# EAGLE schematic Flex (EAGLE 6.6.0)
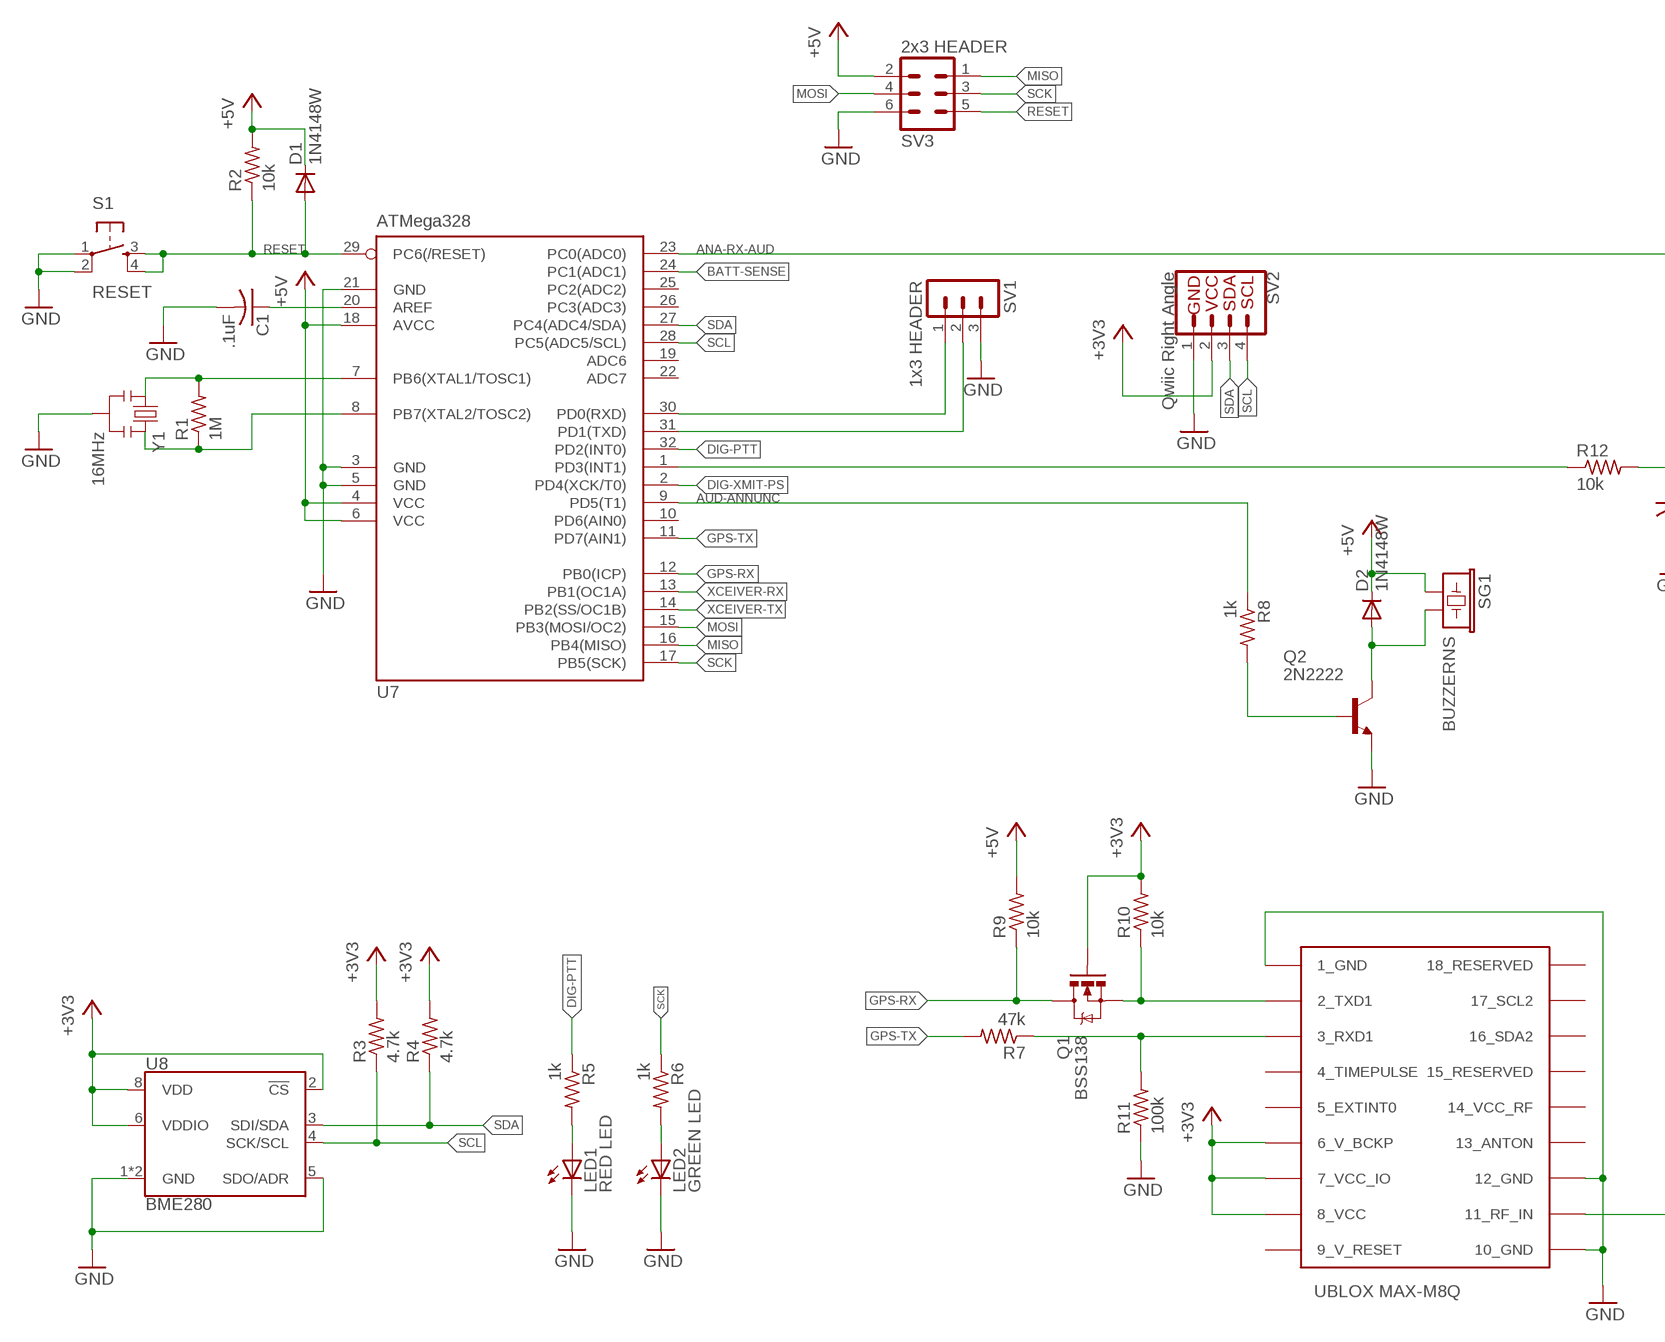
[diagram p0: schematic, sheet 1, part 1 of 2]
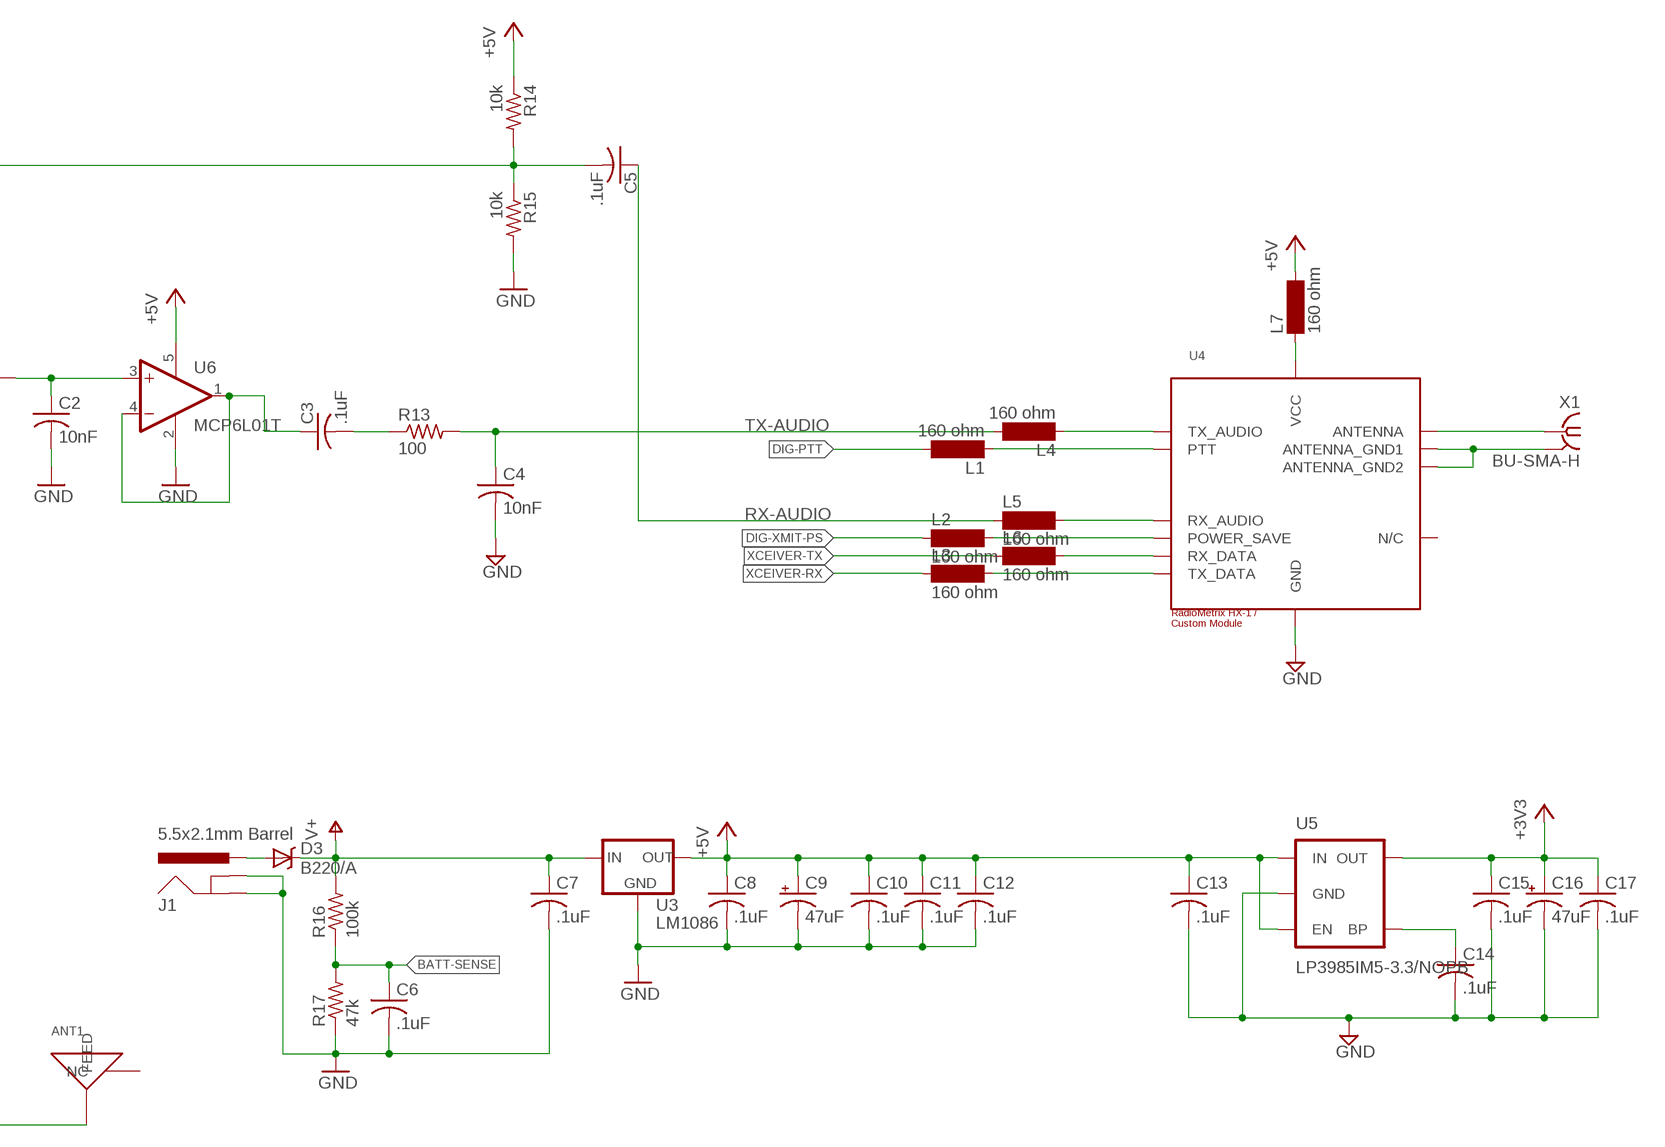
[diagram p1: schematic, sheet 1, part 2 of 2]

## Parts
ANT1  GPS ANTENNA  GPS_ANT_SMDBAR  [1575AT43A40]
C1  .1uF  C-USC0805  [C0805]
C2  10nF  C-USC0805  [C0805]
C3  .1uF  C-USC0805  [C0805]
C4  10nF  C-USC0805  [C0805]
C5  .1uF  C-USC0805  [C0805]
C6  .1uF  C-USC0805  [C0805]
C7  .1uF  C-USC0805  [C0805]
C8  .1uF  C-USC0805  [C0805]
C9  47uF  CPOL-US153CLV-0605  [153CLV-0605]
C10  .1uF  C-USC0805  [C0805]
C11  .1uF  C-USC0805  [C0805]
C12  .1uF  C-USC0805  [C0805]
C13  .1uF  C-USC0805  [C0805]
C14  .1uF  C-USC0805  [C0805]
C15  .1uF  C-USC0805  [C0805]
C16  47uF  CPOL-US153CLV-0605  [153CLV-0605]
C17  .1uF  C-USC0805  [C0805]
D1  1N4148W  DIODE-SOD123  [SOD123]
D2  1N4148W  DIODE-SOD123  [SOD123]
D3  B220/A  B340A  [SMA-DIODE]
J1  5.5x2.1mm Barrel  POWER_JACKSMD  [POWER_JACK_SMD]
L1  160 ohm  SM-1206  [SM-1206]
L2  160 ohm  SM-1206  [SM-1206]
L3  160 ohm  SM-1206  [SM-1206]
L4  160 ohm  SM-1206  [SM-1206]
L5  160 ohm  SM-1206  [SM-1206]
L6  160 ohm  SM-1206  [SM-1206]
L7  160 ohm  SM-1206  [SM-1206]
LED1  RED LED  LEDCHIPLED_1206  [CHIPLED_1206]
LED2  GREEN LED  LEDCHIPLED_1206  [CHIPLED_1206]
Q1  BSS138  MOSFET-NCHANNELBSS138  [SOT23]
Q2  2N2222  BC817-16LT1SMD  [SOT23-BEC]
R1  1M  R-US_R0805  [R0805]
R2  10k  R-US_R0805  [R0805]
R3  4.7k  R-US_R0805  [R0805]
R4  4.7k  R-US_R0805  [R0805]
R5  1k  R-US_R0805  [R0805]
R6  1k  R-US_R0805  [R0805]
R7  47k  R-US_R0805  [R0805]
R8  1k  R-US_R0805  [R0805]
R9  10k  R-US_R0805  [R0805]
R10  10k  R-US_R0805  [R0805]
R11  100k  R-US_R0805  [R0805]
R12  10k  R-US_R0805  [R0805]
R13  100  R-US_R0805  [R0805]
R14  10k  R-US_R0805  [R0805]
R15  10k  R-US_R0805  [R0805]
R16  100k  R-US_R0805  [R0805]
R17  47k  R-US_R0805  [R0805]
S1  RESET  TAC_SWITCHSMD  [TACTILE_SWITCH_SMD]
SG1  BUZZERNS  [BUZZER-12MM-NS]
SV1  1x3 HEADER  MA03-1  [MA03-1]
SV2  Qwiic Right Angle  I2C_STANDARDQWIIC  [1X04_1MM_RA]
SV3  2x3 HEADER  MA03-2  [MA03-2]
U2  UBLOX_MAX  [UBLOX_MAX]
U3  LM1086  LM1086TO263  [TO263]
U4  RADIOMETRIX-HX1-CUSTOM  [RADIOMETRIX-HX1-CUSTOM]
U5  LP3985IM5-3.3/NOPB  V_REG_LDOSMD  [SOT23-5]
U6  MCP6L01T  OPA725DBV  [SOT23-5]
U7  ATMega328  MEGA8-AI  [TQFP32-08]
U8  BME280  [LGA-8-2.5X2.5]
X1  BU-SMA-H  [BU-SMA-H]
Y1  16MHz  RESONATOR16MHZ  [RESONATOR-SMD]

## Nets
+3V3: C15.1 C16.+ C17.1 Q1.1(G) R3.2 R4.2 R10.2 SV2.2 U2.6_V_BCKP U2.7_VCC_IO U2.8_VCC U5.5(OUT) U8.2(!CS) U8.6(VDDIO) U8.8(VDD)
+5V [Power]: C8.1 C9.+ C10.1 C11.1 C12.1 C13.1 D1.C D2.C L7.2 R2.2 R9.2 R14.1 SG1.+ SV3.2 U3.2(OUT) U5.1(IN) U5.3(EN) U6.5(V+) U7.4(VCC) U7.6(VCC) U7.18(AVCC)
ANA-RX-AUD: C5.2 R14.2 R15.1 U7.23(PC0(ADC0))
AUD-ANNUNC: R8.1 U7.9(PD5(T1))
BATT-SENSE: C6.1 R16.1 R17.2 U7.24(PC1(ADC1))
DIG-PTT: L1.2 R5.1 U7.32(PD2(INT0))
DIG-XMIT-PS: L2.1 U7.2(PD4(XCK/T0))
GND [Power]: C1.2 C2.2 C4.2 C6.2 C7.2 C8.2 C9.- C10.2 C11.2 C12.2 C13.2 C14.2 C15.2 C16.- C17.2 J1.GND(GNDBREAK) J1.P$4(GND) LED1.C LED2.C Q2.E R11.1 R15.2 R17.1 S1.1 S1.2 SV1.3 SV2.1 SV3.6 U2.1_GND U2.10_GND U2.12_GND U3.1(GND) U4.GND U5.2(GND) U6.2(V-) U7.3(GND) U7.5(GND) U7.21(GND) U8.1(GND) U8.5(SDO/ADR) U8.7(GND) Y1.2
GPS-RX: Q1.3(D) R9.1 U7.12(PB0(ICP))
GPS-TX: R7.2 U7.11(PD7(AIN1))
MISO: SV3.1 U7.16(PB4(MISO))
MOSI: SV3.4 U7.15(PB3(MOSI/OC2))
N$1: C2.1 R12.2 U6.3(+IN)
N$4: U4.ANTENNA X1.1
N$5: L4.1 U4.TX_AUDIO
N$7: L1.1 U4.PTT
N$8: D3.A J1.VIN0(PWR)
N$9: D2.A Q2.C SG1.-
N$10: C4.1 L4.2 R13.2
N$11: C3.1 U6.1(OUT) U6.4(-IN)
N$12: L5.2 U4.RX_AUDIO
N$13: R12.1 U7.1(PD3(INT1))
N$14: L2.2 U4.POWER_SAVE
N$15: Q1.2(S) R10.1 U2.2_TXD1
N$16: ANT1.FEED U2.11_RF_IN
N$17: R1.1 U7.8(PB7(XTAL2/TOSC2)) Y1.3
N$18: R7.1 R11.2 U2.3_RXD1
N$19: L6.2 U4.RX_DATA
N$20: L3.2 U4.TX_DATA
N$23: LED1.A R5.2
N$25: LED2.A R6.2
N$27: Q2.B R8.2
N$59: C1.1 U7.20(AREF)
N$60: C14.1 U5.4(BP)
N$64: R1.2 U7.7(PB6(XTAL1/TOSC1)) Y1.1
RESET: D1.A R2.1 S1.3 S1.4 SV3.5 U7.29(PC6(/RESET))
RFGND: U4.ANTENNA_GND1 U4.ANTENNA_GND2 X1.2 X1.3 X1.4 X1.5
RX-AUDIO: C5.1 L5.1
RXD: SV1.1 U7.30(PD0(RXD))
SCK: R6.1 SV3.3 U7.17(PB5(SCK))
SCL: R3.1 SV2.4 U7.28(PC5(ADC5/SCL)) U8.4(SCK/SCL)
SDA: R4.1 SV2.3 U7.27(PC4(ADC4/SDA)) U8.3(SDI/SDA)
TX-AUDIO: C3.2 R13.1
TXD: SV1.2 U7.31(PD1(TXD))
V+ [Power]: C7.1 D3.C R16.2 U3.3(IN)
VCC: L7.1 U4.VCC
XCEIVER-RX: L3.1 U7.13(PB1(OC1A))
XCEIVER-TX: L6.1 U7.14(PB2(SS/OC1B))
Unconnected: ANT1.NC U2.4_TIMEPULSE U2.5_EXTINT0 U2.13_ANTON U2.14_VCC_RF U2.15_RESERVED U2.16_SDA2 U2.17_SCL2 U2.18_RESERVED U4.N/C1(N/C) U4.N/C2(N/C) U4.N/C3(N/C) U4.N/C4(N/C) U7.10(PD6(AIN0)) U7.19(ADC6) U7.22(ADC7) U7.25(PC2(ADC2)) U7.26(PC3(ADC3))

## Power pins joined to a net without a drawn wire
9_V_RESET: U2.9_V_RESET

## Library data of the parts
ANT1 = Parts:GPS_ANT_SMDBAR: 1.575 GHz GPS Antenna Johanson Technology http://www.digikey.com/product-detail/en/1575AT43A0040E/712-1003-1-ND/1560832; DIGIKEY: 712-1003-1-ND
C1 C3 C5-C8 C10-C15 C17 = resistor:C-US: CAPACITOR, American symbol; DIGIKEY: 311-1361-1-ND
C2 C4 = resistor:C-US: CAPACITOR, American symbol; DIGIKEY: 399-1158-1-ND
C9 C16 = resistor:CPOL-US: POLARIZED CAPACITOR, American symbol; DIGIKEY: PCE3842CT-ND
D1 D2 = custom-ds:DIODE-: DIODE; DIGIKEY: 1N4148W-FDICT-ND
D3 = SparkFun-DiscreteSemi:B340A: Schottky Diode 3A-40V; DIGIKEY: 641-1258-1-ND; PROD_ID: DIO-09886; VALUE: BA340A
J1 = SparkFun-Connectors:POWER_JACK: Power Jack Connector This is the standard 5.5mm barrel jack for power. The PTH is the most common, proven, reliable, footprint. The Slot footprint only works if the mill layer is transmitted to the PCB fab house so be warned. Here are the connectors we sell at SparkFun: DC Barrel Power Jack/Connector <https://www.sparkfun.com/products/119> (PRT-00119) DC Barrel Power Jack/Connector (SMD) <https://www.sparkfun.com/products/12748> (PRT-12748) DC Barrel Jack Adapter - Breadboard Compatible <https://www.sparkfun.com/products/10811> (PRT-10811) It is used on this SparkFun product (and many, many others): SparkFun RedBoard - Programmed with Arduino <https://www.sparkfun.com/products/12757> (DEV-12757) Also, if you need a mating power supply or connector, please check these out: Wall Adapter Power Supply - 9VDC 650mA <https://www.sparkfun.com/products/298> (TOL-00298) DC Barrel Jack Adapter - Male <https://www.sparkfun.com/products/10287> (PRT-10287); DIGIKEY: CP-002AHPJCT-ND; PROD_ID: CONN-08106; SF_ID: PRT-12748
L1-L7 = inductor-neosid:SM-1206: INDUCTOR SMD chip inductor; DIGIKEY: 240-2411-1-ND; OC_FARNELL: unknown; OC_NEWARK: unknown
LED1 = led:LED: LED OSRAM: - CHIPLED LG R971, LG N971, LY N971, LG Q971, LY Q971, LO R971, LY R971 LH N974, LH R974 LS Q976, LO Q976, LY Q976 LO Q996 - Hyper CHIPLED LW Q18S LB Q993, LB Q99A, LB R99A - SideLED LS A670, LO A670, LY A670, LG A670, LP A670 LB A673, LV A673, LT A673, LW A673 LH A674 LY A675 LS A676, LA A676, LO A676, LY A676, LW A676 LS A679, LY A679, LG A679 - Hyper Micro SIDELED® LS Y876, LA Y876, LO Y876, LY Y876 LT Y87S - SmartLED LW L88C, LW L88S LB L89C, LB L89S, LG L890 LS L89K, LO L89K, LY L89K LS L896, LA L896, LO L896, LY L896 - TOPLED LS T670, LO T670, LY T670, LG T670, LP T670 LSG T670, LSP T670, LSY T670, LOP T670, LYG T670 LG T671, LOG T671, LSG T671 LB T673, LV T673, LT T673, LW T673 LH T674 LS T676, LA T676, LO T676, LY T676, LB T676, LH T676, LSB T676, LW T676 LB T67C, LV T67C, LT T67C, LS T67K, LO T67K, LY T67K, LW E67C LS E67B, LA E67B, LO E67B, LY E67B, LB E67C, LV E67C, LT E67C LW T67C LS T679, LY T679, LG T679 LS T770, LO T770, LY T770, LG T770, LP T770 LB T773, LV T773, LT T773, LW T773 LH T774 LS E675, LA E675, LY E675, LS T675 LS T776, LA T776, LO T776, LY T776, LB T776 LHGB T686 LT T68C, LB T68C - Hyper Mini TOPLED® LB M676 - Mini TOPLED Santana® LG M470 LS M47K, LO M47K, LY M47K Source: http://www.osram.convergy.de LUXEON: - LUMILED® LXK2-PW12-R00, LXK2-PW12-S00, LXK2-PW14-U00, LXK2-PW14-V00 LXK2-PM12-R00, LXK2-PM12-S00, LXK2-PM14-U00 LXK2-PE12-Q00, LXK2-PE12-R00, LXK2-PE12-S00, LXK2-PE14-T00, LXK2-PE14-U00 LXK2-PB12-K00, LXK2-PB12-L00, LXK2-PB12-M00, LXK2-PB14-N00, LXK2-PB14-P00, LXK2-PB14-Q00 LXK2-PR12-L00, LXK2-PR12-M00, LXK2-PR14-Q00, LXK2-PR14-R00 LXK2-PD12-Q00, LXK2-PD12-R00, LXK2-PD12-S00 LXK2-PH12-R00, LXK2-PH12-S00 LXK2-PL12-P00, LXK2-PL12-Q00, LXK2-PL12-R00 Source: www.luxeon.com KINGBRIGHT: KA-3528ASYC Source: www.kingbright.com; DIGIKEY: 160-1405-1-ND
LED2 = led:LED: LED OSRAM: - CHIPLED LG R971, LG N971, LY N971, LG Q971, LY Q971, LO R971, LY R971 LH N974, LH R974 LS Q976, LO Q976, LY Q976 LO Q996 - Hyper CHIPLED LW Q18S LB Q993, LB Q99A, LB R99A - SideLED LS A670, LO A670, LY A670, LG A670, LP A670 LB A673, LV A673, LT A673, LW A673 LH A674 LY A675 LS A676, LA A676, LO A676, LY A676, LW A676 LS A679, LY A679, LG A679 - Hyper Micro SIDELED® LS Y876, LA Y876, LO Y876, LY Y876 LT Y87S - SmartLED LW L88C, LW L88S LB L89C, LB L89S, LG L890 LS L89K, LO L89K, LY L89K LS L896, LA L896, LO L896, LY L896 - TOPLED LS T670, LO T670, LY T670, LG T670, LP T670 LSG T670, LSP T670, LSY T670, LOP T670, LYG T670 LG T671, LOG T671, LSG T671 LB T673, LV T673, LT T673, LW T673 LH T674 LS T676, LA T676, LO T676, LY T676, LB T676, LH T676, LSB T676, LW T676 LB T67C, LV T67C, LT T67C, LS T67K, LO T67K, LY T67K, LW E67C LS E67B, LA E67B, LO E67B, LY E67B, LB E67C, LV E67C, LT E67C LW T67C LS T679, LY T679, LG T679 LS T770, LO T770, LY T770, LG T770, LP T770 LB T773, LV T773, LT T773, LW T773 LH T774 LS E675, LA E675, LY E675, LS T675 LS T776, LA T776, LO T776, LY T776, LB T776 LHGB T686 LT T68C, LB T68C - Hyper Mini TOPLED® LB M676 - Mini TOPLED Santana® LG M470 LS M47K, LO M47K, LY M47K Source: http://www.osram.convergy.de LUXEON: - LUMILED® LXK2-PW12-R00, LXK2-PW12-S00, LXK2-PW14-U00, LXK2-PW14-V00 LXK2-PM12-R00, LXK2-PM12-S00, LXK2-PM14-U00 LXK2-PE12-Q00, LXK2-PE12-R00, LXK2-PE12-S00, LXK2-PE14-T00, LXK2-PE14-U00 LXK2-PB12-K00, LXK2-PB12-L00, LXK2-PB12-M00, LXK2-PB14-N00, LXK2-PB14-P00, LXK2-PB14-Q00 LXK2-PR12-L00, LXK2-PR12-M00, LXK2-PR14-Q00, LXK2-PR14-R00 LXK2-PD12-Q00, LXK2-PD12-R00, LXK2-PD12-S00 LXK2-PH12-R00, LXK2-PH12-S00 LXK2-PL12-P00, LXK2-PL12-Q00, LXK2-PL12-R00 Source: www.luxeon.com KINGBRIGHT: KA-3528ASYC Source: www.kingbright.com; DIGIKEY: 160-1169-1-ND
Q1 = SparkFun-DiscreteSemi:MOSFET-NCHANNEL: Common NMOSFET Parts MFG P/N Store ID Prod ID FDD8780 TRANS-09984 SI7820DN TRANS-11055 FDS6630A IC-08089 2N7002PW TRANS-11151 FQP30N06L COM-10213 TRANS-10060 BSS123LT1G TRANS-08345 BSS138 TRANS-00830 BS170 2N7000; DIGIKEY: BSS138KCT-ND; PROD_ID: TRANS-00830
Q2 = transistor-npn:BC817*: NPN Transistor; DIGIKEY: MMBT2222AFSCT-ND
R1 = resistor:R-US_: RESISTOR, American symbol; DIGIKEY: 311-1.0MARCT-ND
R2 R9 R10 R12 R14 R15 = resistor:R-US_: RESISTOR, American symbol; DIGIKEY: 311-10.0KCRCT-ND
R3 R4 = resistor:R-US_: RESISTOR, American symbol; DIGIKEY: 311-4.7KARCT-ND
R5 R6 R8 = resistor:R-US_: RESISTOR, American symbol; DIGIKEY: 311-1.0KARCT-ND
R7 R17 = resistor:R-US_: RESISTOR, American symbol; DIGIKEY: 311-47.0KCRCT-ND
R11 R16 = resistor:R-US_: RESISTOR, American symbol; DIGIKEY: 311-100KCRCT-ND
R13 = resistor:R-US_: RESISTOR, American symbol; DIGIKEY: 311-100ARCT-ND
S1 = SparkFun-Electromechanical:TAC_SWITCH: Momentary Switch Button commonly used for reset or general input. Spark Fun Electronics SKU : COM-00097 SMT- SWCH-08247; DIGIKEY: CKN9104CT-ND; PROD_ID: SWCH-08247
SG1 = SparkFun-Electromechanical:BUZZER: Buzzer 12mm Spark Fun Electronics SKU : Comp-Buzzer; DIGIKEY: 102-1155-ND
SV1 = con-lstb:MA03-1: PIN HEADER; DIGIKEY: 952-2264-ND; OC_FARNELL: unknown; OC_NEWARK: unknown
SV2 = SparkFun-Connectors:I2C_STANDARD: SparkFun I2C Standard Pinout Header SparkFun has standardized on a pinout for all I2C based sensor breakouts. This pinout allows I2C boards to be plugged directly into the headers on Arduino Uno compatible boards, and to be daisy chained easily. Example SparkFun Products: SparkFun Atmospheric Sensor Breakout - BME280 <https://www.sparkfun.com/products/13676> SparkFun Altitude/Pressure Sensor Breakout - MPL3115A2 <https://www.sparkfun.com/products/11084> SparkFun TOF Range Finder Sensor - VL6180 <https://www.sparkfun.com/products/12785>; PROD_ID: CONN-13694
SV3 = con-lstb:MA03-2: PIN HEADER; DIGIKEY: 952-2121-ND; OC_FARNELL: unknown; OC_NEWARK: unknown
U2 = Ava:UBLOX_MAX: UBLOX MAX; ALT-PART: UBLOX MAX-M8Q; DIGIKEY: 672-1003-1-ND
U3 = v-reg-2:LM1086; DIGIKEY: LM1086ISX-5.0/NOPBCT-ND
U4 = custom-ds:RADIOMETRIX-HX1-CUSTOM
U5 = SparkFun-PowerIC:V_REG_LDO: Voltage Regulator LDO Standard 150mA LDO voltage regulator in SOT-23 layout. Micrel part MIC5205. BP (by-pass) pin is used to lower output noise with 470pF cap.; DIGIKEY: LP3985IM5-3.3/NOPBCT-ND
U6 = linear:OPA725: Very Low Noise, High-Speed, 12V CMOS Operational Amplifier Source: http://focus.ti.com/lit/ds/symlink/opa725.pdf; DIGIKEY: MCP6L01T-E/OTCT-ND
U7 = atmel:MEGA8: MICROCONTROLLER 8 Kbytes FLASH, 1 kbytes SRAM, 512 bytes EEPROM, USART, 6-channel 10 bit ADC, 2-channel 8 bit ADC Pin compatible with Atmega48, ATMega88, ATMega168 Source: avr.lbr; DIGIKEY: ATMEGA328P-AU-ND; MPN: ATMEGA8-16AU; OC_FARNELL: 9171371; OC_NEWARK: 73M8863
U8 = SparkFun-Sensors:BME280: Bosch BME280 – Combined Humidity and Pressure Sensor The BME280 is as combined digital humidity, pressure and temperature sensor based on proven sensing principles. The sensor module is housed in an extremely compact metal-lid LGA package with a footprint of only 2.5×2.5mm² with a height of 0.93mm. Its small dimensions and its low power consumption allow the implementation in battery driven devices such as handsets, GPS modules or watches. Datasheet <https://cdn.sparkfun.com/assets/learn_tutorials/4/1/9/BST-BME280_DS001-10.pdf> SparkFun Products SparkFun Atmospheric Sensor Breakout - BME280 <https://www.sparkfun.com/products/13676> (SEN-13676); PROD_ID: IC-13090
X1 = con-coax:BU-SMA-H: FEMALE SMA CONNECTOR Radiall; DIGIKEY: CONSMA001-ND; OC_FARNELL: unknown; OC_NEWARK: unknown
Y1 = SparkFun-FreqCtrl:RESONATOR: Resonator Small SMD resonator. Used, eg, on the Arduino Pro/ Pro Mini boards. 8MHz- XTAL-08895 16MHz- XTAL-08900; DIGIKEY: 478-5420-1-ND; PROD_ID: XTAL-08900

## Net classes
1 Power: width 0.127 mm, clearance 0.025 mm